# Altium schematic sheet shcematics.SchDoc: Ultra-Precision low speed ramp generator for low current calibration
size A2; PageSetup: Record=PageOptions|CenterHorizontal=True|CenterVertical=True|PrintScale=0.52|XCorrection=1.00|YCorrection=1.00|PrintKind=0|BorderSize=5000000|LeftOffset=0|BottomOffset=0|Orientation=2|PaperLength=1000|PaperWidth=1000|Scale=100|PaperSource=7|PrintQuality=-3|MediaType=1|DitherType=10|PrintScaleMode=1|PaperKind=A4|PaperIndex=9
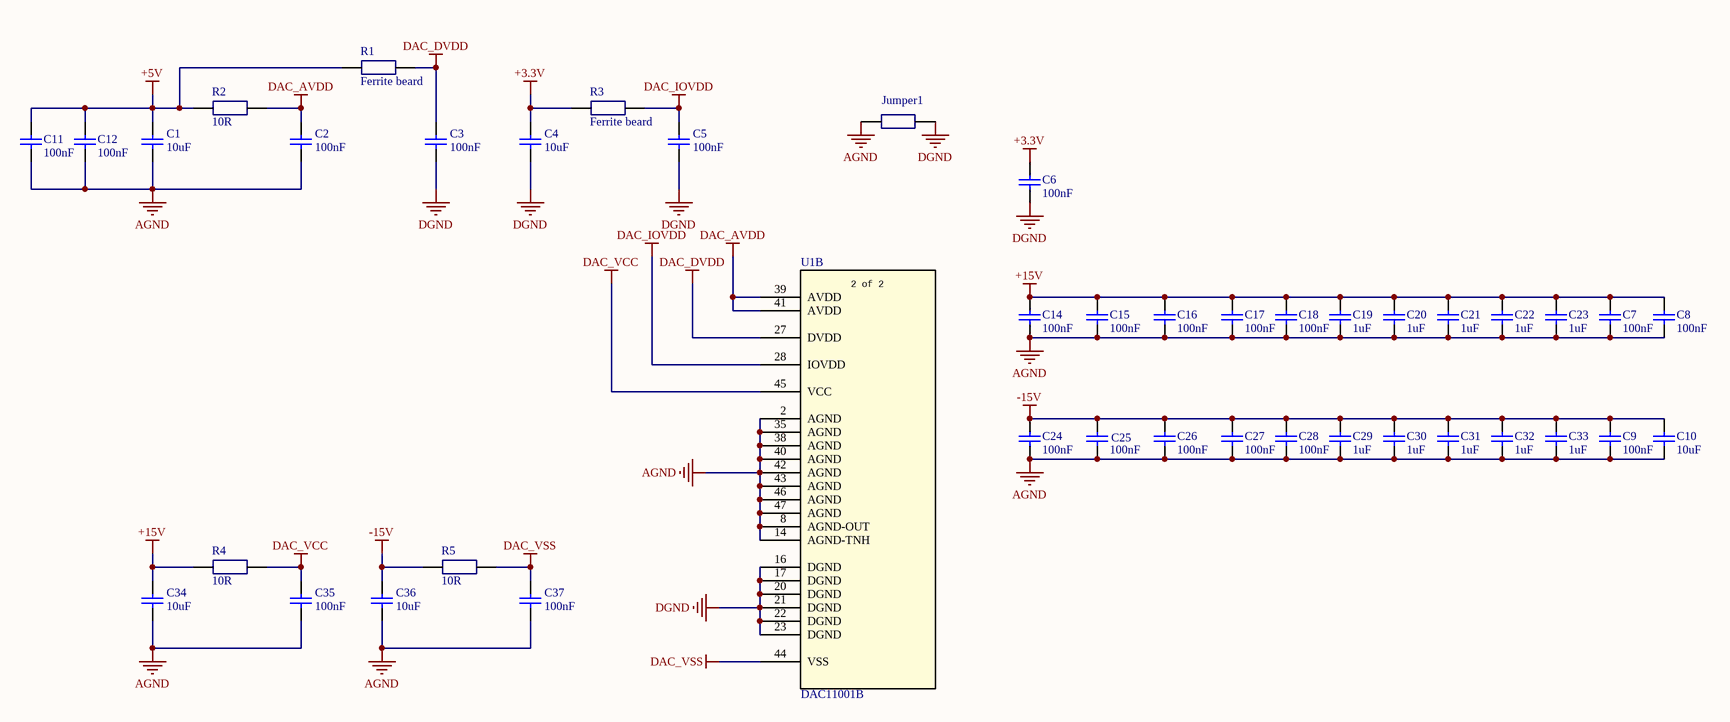
[diagram p0: shcematics.SchDoc]

## Parts
C1  10uF  [CAP 0603]
C2  100nF  [CAP 0603]
C3  100nF  [CAP 0603]
C4  10uF  [CAP 0603]
C5  100nF  [CAP 0603]
C6  100nF  [CAP 0603]
C7  100nF  [CAP 0603]
C8  100nF  [CAP 0603]
C9  100nF  [CAP 0603]
C10  10uF  [CAP 0603]
C11  100nF  [CAP 0603]
C12  100nF  [CAP 0603]
C14  100nF  [CAP 0603]
C15  100nF  [CAP 0603]
C16  100nF  [CAP 0603]
C17  100nF  [CAP 0603]
C18  100nF  [CAP 0603]
C19  1uF  [CAP 0603]
C20  1uF  [CAP 0603]
C21  1uF  [CAP 0603]
C22  1uF  [CAP 0603]
C23  1uF  [CAP 0603]
C24  100nF  [CAP 0603]
C25  100nF  [CAP 0603]
C26  100nF  [CAP 0603]
C27  100nF  [CAP 0603]
C28  100nF  [CAP 0603]
C29  1uF  [CAP 0603]
C30  1uF  [CAP 0603]
C31  1uF  [CAP 0603]
C32  1uF  [CAP 0603]
C33  1uF  [CAP 0603]
C34  10uF  [C1206]
C35  100nF  [CAP 0603]
C36  10uF  [C1206]
C37  100nF  [CAP 0603]
Jumper1  (no value)  [0402 jumper]  (net tie, no BOM)
R1  Ferrite beard  [CC1206JRNPOBBN100]
R2  10R  [1608[0603]]
R3  Ferrite beard  [CC1206JRNPOBBN100]
R4  10R  [1608[0603]]
R5  10R  [1608[0603]]
U1  DAC11001B  [QFP_APFBR_TEX]  (part B of 2)

## Nets
+3.3V: C4.1 C6.2 R3.2
+5V: C1.1 C11.2 C12.2 R1.2 R2.2
+15V: C7.2 C8.2 C14.2 C15.2 C16.2 C17.2 C18.2 C19.2 C20.2 C21.2 C22.2 C23.2 C34.1 R4.2
-15V: C9.2 C10.2 C24.2 C25.2 C26.2 C27.2 C28.2 C29.2 C30.2 C31.2 C32.2 C33.2 C36.1 R5.2
AGND: C1.2 C2.2 C7.1 C8.1 C9.1 C10.1 C11.1 C12.1 C14.1 C15.1 C16.1 C17.1 C18.1 C19.1 C20.1 C21.1 C22.1 C23.1 C24.1 C25.1 C26.1 C27.1 C28.1 C29.1 C30.1 C31.1 C32.1 C33.1 C34.2 C35.2 C36.2 C37.2 Jumper1.2 U1.2(AGND) U1.8(AGND-OUT) U1.14(AGND-TNH) U1.35(AGND) U1.38(AGND) U1.40(AGND) U1.42(AGND) U1.43(AGND) U1.46(AGND) U1.47(AGND)
DAC_AVDD: C2.1 R2.1(A) U1.39(AVDD) U1.41(AVDD)
DAC_DVDD: C3.1 R1.1(A) U1.27(DVDD)
DAC_IOVDD: C5.1 R3.1(A) U1.28(IOVDD)
DAC_VCC: C35.1 R4.1(A) U1.45(VCC)
DAC_VSS: C37.1 R5.1(A) U1.44(VSS)
DGND: C3.2 C4.2 C5.2 C6.1 Jumper1.1(A) U1.16(DGND) U1.17(DGND) U1.20(DGND) U1.21(DGND) U1.22(DGND) U1.23(DGND)

## Notes on the sheet
- (in symbol DAC11001APFBR, part B) 2 of 2

## Library data of the parts
C1-C12 C14-C37 = Cap Semi: Capacitor (Semiconductor SIM Model); Order: CC0603KRX7R8BB104; Published: 8-Jun-2000; LatestRevisionDate: 29-May-2009; LatestRevisionNote: IPC-7351 Footprint Added.; PackageReference: C1206; Publisher: Altium Limited; PackageDescription: Chip Capacitor
  C1 C4 C10 C34 C36: Value: 10uF
  C2 C3 C5-C9 C11 C12 C14-C18 C24-C28 C35 C37: Value: 100nF
  C19-C23 C29-C33: Value: 1uF
Jumper1 = Resistor 0805: Avail: 20
R1-R5 = Resistor 0805: Order: ERA-3AEB4992V; Avail: 20
  R1 R3: Value: Ferrite beard
  R2 R4 R5: Value: 10R
U1 = DAC11001APFBR: No Description Available; Vendor: Texas Instruments; Built_By: EMA_Matt; SourceLibrary: Texas_Instruments_2020-07-20; Manufacturer_Part_Number: DAC11001APFBR; Copyright: Copyright (C) 2018 Accelerated Designs. All rights reserved; Datasheet: https://www.ti.com/lit/ds/symlink/dac11001a.pdf; RefDes: RefDes; Type: DEV